# EAGLE design uav_pantilt (EAGLE 6.4)
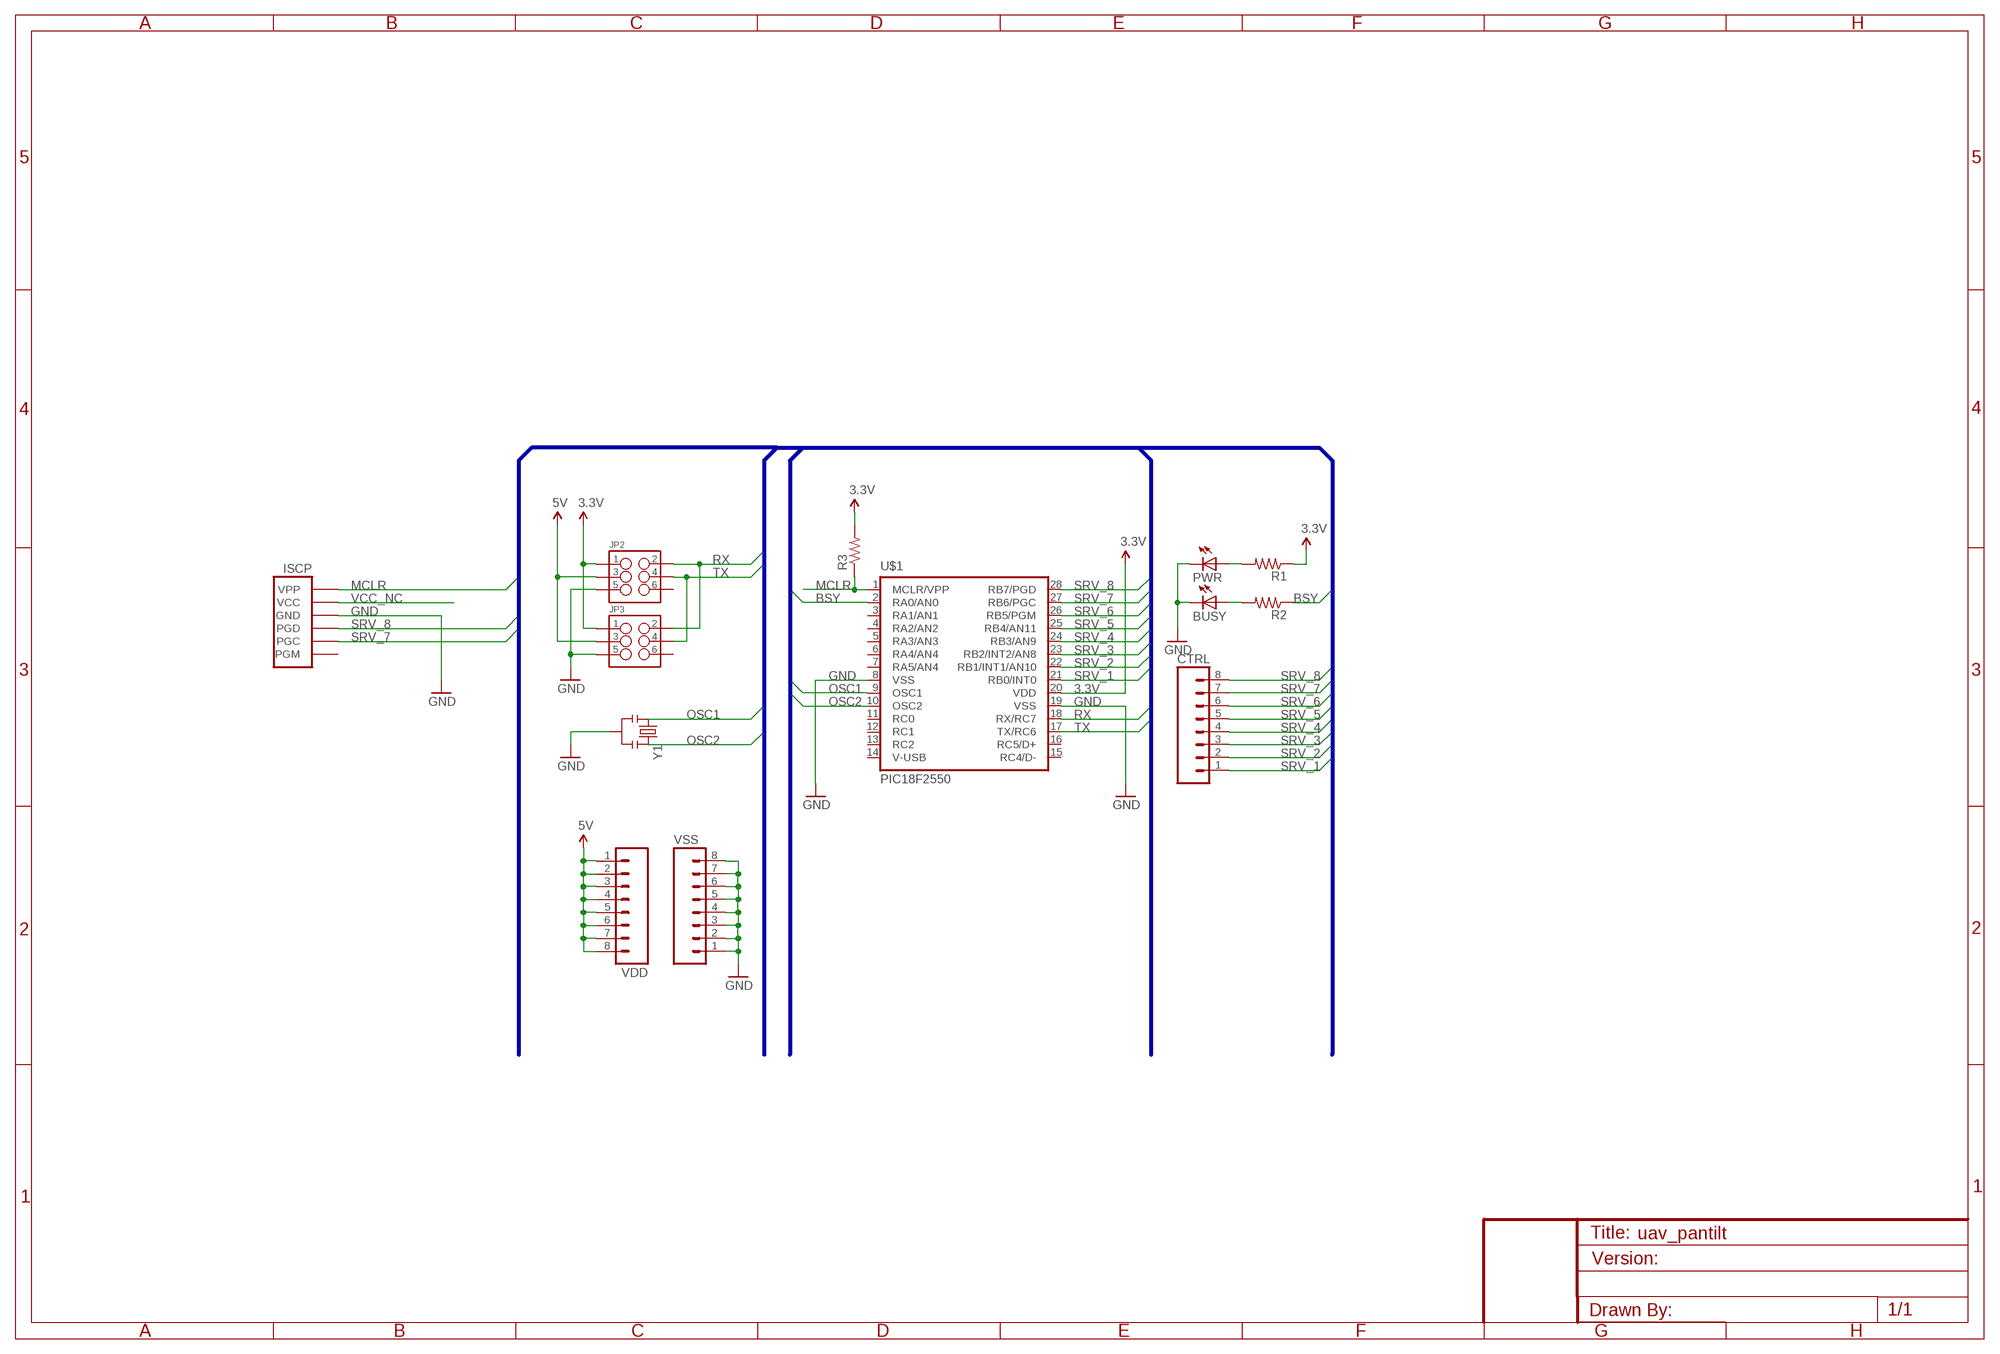
[diagram p0: schematic, sheet 1]

## Parts
BUSY  LED5MM  [LED5MM]
CTRL  M08LOCK  [1X08_LOCK]
ISCP  PIC-ICSPPOLAR_LOCK  [MOLEX-1X6_LOCK]
JP2  M03X2  [2X3-SHROUDED]
JP3  M03X2  [2X3-SHROUDED]
PWR  LED5MM  [LED5MM]
R1  RESISTORKIT  [AXIAL-0.3-KIT]
R2  RESISTORKIT  [AXIAL-0.3-KIT]
R3  RESISTORKIT  [AXIAL-0.3-KIT]
U$1  PIC18F2550  [DIL28-3]
VDD  M08LOCK  [1X08_LOCK]
VSS  M08LOCK  [1X08_LOCK]
Y1  RESONATORPTH  [RESONATOR-PTH]

## Nets
3.3V: JP2.1 JP3.1 R1.P$1 R3.P$2 U$1.20(VDD)
5V: JP2.3 JP3.3 VDD.1 VDD.2 VDD.3 VDD.4 VDD.5 VDD.6 VDD.7 VDD.8
BSY: R2.P$1 U$1.2(RA0/AN0)
GND: BUSY.K(C) ISCP.4(GND) JP2.5 JP3.5 PWR.K(C) U$1.8(VSS) U$1.19(VSS) VSS.1 VSS.2 VSS.3 VSS.4 VSS.5 VSS.6 VSS.7 VSS.8 Y1.2
MCLR: ISCP.6(VPP) R3.P$1 U$1.1(MCLR/VPP)
N$1: PWR.A R1.P$2
N$2: BUSY.A R2.P$2
OSC1: U$1.9(OSC1) Y1.1
OSC2: U$1.10(OSC2) Y1.3
RX: JP2.2 JP3.2 U$1.18(RX/RC7)
SRV_1: CTRL.1 U$1.21(RB0/INT0)
SRV_2: CTRL.2 U$1.22(RB1/INT1/AN10)
SRV_3: CTRL.3 U$1.23(RB2/INT2/AN8)
SRV_4: CTRL.4 U$1.24(RB3/AN9)
SRV_5: CTRL.5 U$1.25(RB4/AN11)
SRV_6: CTRL.6 U$1.26(RB5/PGM)
SRV_7: CTRL.7 ISCP.2(PGC) U$1.27(RB6/PGC)
SRV_8: CTRL.8 ISCP.3(PGD) U$1.28(RB7/PGD)
TX: JP2.4 JP3.4 U$1.17(TX/RC6)
VCC_NC: ISCP.5(VCC)
Unconnected: ISCP.1(PGM) JP2.6 JP3.6 U$1.3(RA1/AN1) U$1.4(RA2/AN2) U$1.5(RA3/AN3) U$1.6(RA4/AN4) U$1.7(RA5/AN4) U$1.11(RC0) U$1.12(RC1) U$1.13(RC2) U$1.14(V-USB) U$1.15(RC4/D-) U$1.16(RC5/D+)

## Buses
B$1

## Library data of the parts
BUSY PWR = SparkFun-LED:LED: LEDs Standard schematic elements and footprints for 5mm, 3mm, 1206, and 0603 sized LEDs. 5mm - Spark Fun Electronics SKU : COM-00529 (and others)
CTRL VDD VSS = SparkFun-Connectors:M08: Header 8 Standard 8-pin 0.1" header. Use with straight break away headers (SKU : PRT-00116), right angle break away headers (PRT-00553), swiss pins (PRT-00743), machine pins (PRT-00117), and female headers (PRT-00115).
ISCP = SparkFun-Connectors:PIC-ICSP: ISCP Programming connector for UAV, UBW Kit, etc.
JP2 JP3 = SparkFun-Connectors:M03X2: 2x3 .1" header. Shrouded, with keying- CONN-10681 SMT- CONN-11415 Pogo pins- HW-11044; PROD_ID: CONN-10681
R1-R3 = SparkFun-Resistors:RESISTOR: Resistor Basic schematic elements and footprints for 0603, 1206, and PTH resistors.
U$1 = SparkFun-DigitalIC:PIC18F2550
Y1 = SparkFun-FreqCtrl:RESONATOR: Resonator Small SMD resonator. Used, eg, on the Arduino Pro/ Pro Mini boards. 8MHz- XTAL-08895 16MHz- XTAL-08900

## Board
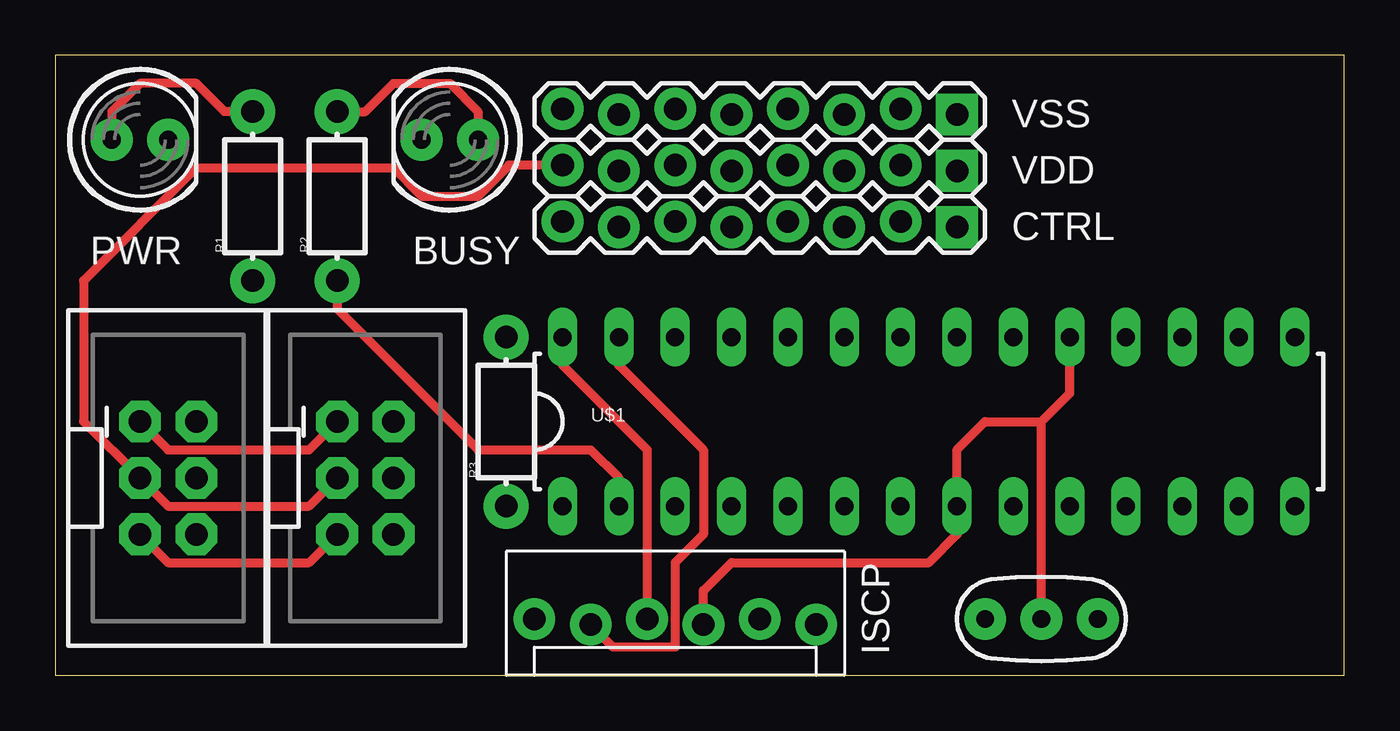
[diagram p1: board, top side]
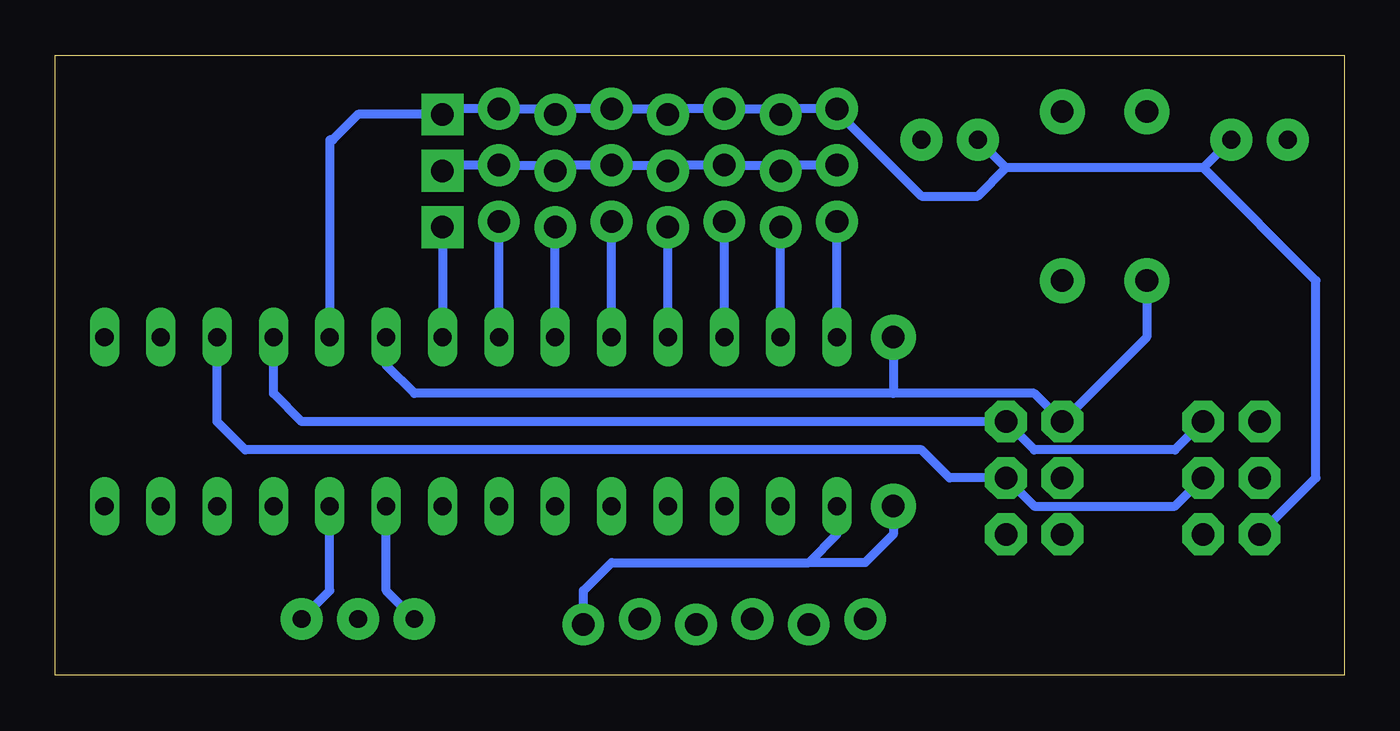
[diagram p2: board, bottom side, seen from below]

Size 58.09 x 27.93 mm. Coordinates in mm from the lower left corner, seen from the top.
Outline: 0,0 58.09,0 58.09,27.93 0,27.93 0,0
Copper layers (1*16): Top 0.035mm / dielectric 1.5mm / Bottom 0.035mm
Design rules "default": minimum track width 10mil, minimum drill 24mil, track to track 8mil, track to pad 8mil, pad to pad 8mil, via to via 8mil, smd to smd 8mil, copper to edge 40mil, drill to drill 8mil, minimum pad ring 10mil, minimum via ring 8mil, stop-mask expansion 4mil, vias tented up to drill 0mil, thermal gap 10mil

### Footprints (pad centres in the part's own frame; a part is rotated, then mirrored left to right if it is on the bottom)
LED5MM = drill 0.813 pad 1.88: A -1.27,0; K 1.27,0
1X08_LOCK = drill 1.016 pad 1.88 square: 1 0,0.127 | drill 1.016 pad 1.88: 2 2.54,-0.127; 3 5.08,0.127; 4 7.62,-0.127; 5 10.16,0.127; 6 12.7,-0.127; 7 15.24,0.127; 8 17.78,-0.127
MOLEX-1X6_LOCK = drill 1.016 pad 1.88: 1 0,0; 2 2.54,-0.254; 3 5.08,0; 4 7.62,-0.254; 5 10.16,0; 6 12.7,-0.254
2X3-SHROUDED = drill 1.016 pad 1.88 octagon: 1 -1.27,2.54; 2 1.27,2.54; 3 -1.27,0; 4 1.27,0; 5 -1.27,-2.54; 6 1.27,-2.54
AXIAL-0.3-KIT = drill 1.016 pad 2.032: P$1 -3.81,0; P$2 3.81,0
DIL28-3 = drill 0.813 long: 1 -16.51,-3.81; 2 -13.97,-3.81; 3 -11.43,-3.81; 4 -8.89,-3.81; 5 -6.35,-3.81; 6 -3.81,-3.81; 7 -1.27,-3.81; 8 1.27,-3.81; 9 3.81,-3.81; 10 6.35,-3.81; 11 8.89,-3.81; 12 11.43,-3.81; 13 13.97,-3.81; 14 16.51,-3.81; 15 16.51,3.81; 16 13.97,3.81; 17 11.43,3.81; 18 8.89,3.81; 19 6.35,3.81; 20 3.81,3.81; 21 1.27,3.81; 22 -1.27,3.81; 23 -3.81,3.81; 24 -6.35,3.81; 25 -8.89,3.81; 26 -11.43,3.81; 27 -13.97,3.81; 28 -16.51,3.81
RESONATOR-PTH = drill 0.8 pad 1.88: 1 -2.54,0; 2 0,0; 3 2.54,0

### Placement (x,y rotation side)
BUSY  17.78,24.13 180 top
CTRL  40.64,20.32 180 top
ISCP  21.59,2.54 0 top
JP2  13.97,8.89 0 top
JP3  5.08,8.89 0 top
PWR  3.81,24.13 0 top
R1  8.89,21.59 90 top
R2  12.7,21.59 90 top
R3  20.32,11.43 90 top
U$1  39.37,11.43 0 top
VDD  40.64,22.86 180 top
VSS  40.64,25.4 180 top
Y1  44.45,2.54 0 top

### Tracks (layer width: path | path; a pad name or v marks a point on that pad's centre or on a via)
3.3V
  Top 0.406: JP3.1 5.08,10.16 11.43,10.16 JP2.1
  Bottom 0.406: 20.32,12.7 13.97,12.7 JP2.1 8.89,15.24 R1.P$1 | 20.32,12.7 41.91,12.7 43.18,13.97 U$1.20 | R3.P$2 20.32,12.7
5V
  Top 0.406: JP2.3 11.43,7.62 5.08,7.62 JP3.3 1.27,11.43 1.27,17.78 6.35,22.86 15.24,22.86 16.51,21.59 19.05,21.59 20.45,22.99 VDD.8
  Bottom 0.406: VDD.8 25.4,22.99 | 25.4,22.99 VDD.6 30.48,22.99 | 25.4,22.99 VDD.7 | 30.48,22.99 VDD.4 35.56,22.99 | 30.48,22.99 VDD.5 | 35.56,22.99 VDD.2 40.64,22.99 VDD.1 | 35.56,22.99 VDD.3
BSY
  Top 0.406: R2.P$1 12.7,16.51 19.05,10.16 24.13,10.16 25.4,8.89 U$1.2
GND
  Top 0.406: JP3.5 5.08,5.08 11.43,5.08 JP2.5 | Y1.2 44.45,11.43 | 44.45,11.43 45.72,12.7 U$1.19 | 44.45,11.43 41.91,11.43 40.64,10.16 U$1.8 40.64,6.35 39.37,5.08 30.48,5.08 29.21,3.81 ISCP.4
  Bottom 0.406: 25.4,25.53 VSS.8 22.86,25.4 19.05,21.59 16.51,21.59 15.24,22.86 | 25.4,25.53 VSS.6 30.48,25.53 | 25.4,25.53 VSS.7 | 30.48,25.53 VSS.4 35.56,25.53 | 30.48,25.53 VSS.5 | 35.56,25.53 VSS.2 40.64,25.53 VSS.1 44.45,25.27 45.59,24.13 45.72,24.13 U$1.19 | 35.56,25.53 VSS.3 | JP3.5 1.27,8.89 1.27,17.78 6.35,22.86 | 6.35,22.86 PWR.K | 6.35,22.86 15.24,22.86 | 15.24,22.86 BUSY.K
MCLR
  Bottom 0.406: ISCP.6 34.29,3.81 33.02,5.08 24.13,5.08 | 24.13,5.08 22.86,6.35 U$1.1 | R3.P$1 20.32,6.35 21.59,5.08 24.13,5.08
N$1
  Top 0.406: R1.P$2 7.62,25.4 6.35,26.67 3.81,26.67 2.54,25.4 PWR.A
N$2
  Top 0.406: R2.P$2 13.97,25.4 15.24,26.67 17.78,26.67 19.05,25.4 BUSY.A
OSC1
  Bottom 0.406: Y1.1 43.18,3.81 U$1.9
OSC2
  Bottom 0.406: Y1.3 45.72,3.81 U$1.10
RX
  Bottom 0.406: JP3.2 7.62,10.16 13.97,10.16 JP2.2 46.99,11.43 48.26,12.7 U$1.18
SRV_1
  Bottom 0.406: CTRL.1 U$1.21
SRV_2
  Bottom 0.406: U$1.22 CTRL.2
SRV_3
  Bottom 0.406: U$1.23 CTRL.3
SRV_4
  Bottom 0.406: U$1.24 CTRL.4
SRV_5
  Bottom 0.406: U$1.25 CTRL.5
SRV_6
  Bottom 0.406: U$1.26 CTRL.6
SRV_7
  Top 0.406: U$1.27 25.4,13.97 29.21,10.16 29.21,6.35 27.94,5.08 27.94,1.27 25.15,1.27 ISCP.2
  Bottom 0.406: U$1.27 CTRL.7
SRV_8
  Top 0.406: U$1.28 22.86,13.97 26.67,10.16 ISCP.3
  Bottom 0.406: U$1.28 CTRL.8
TX
  Bottom 0.406: JP3.4 7.62,7.62 13.97,7.62 JP2.4 17.78,8.89 19.05,10.16 49.53,10.16 50.8,11.43 U$1.17